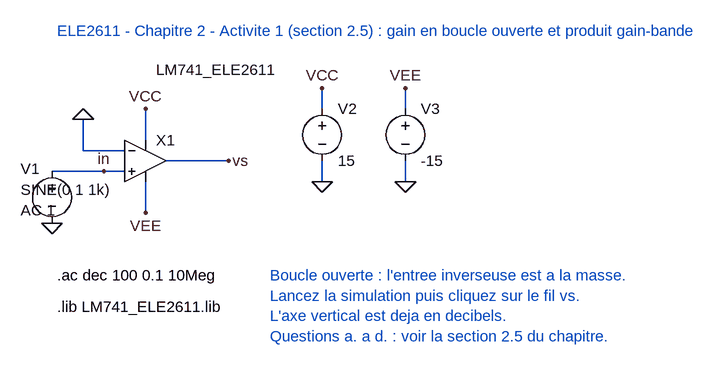
[diagram p0: schematic Ch2_Act1_GainBoucleOuverte.asc]
Ch2_Act1_GainBoucleOuverte.asc, the LTspice schematic file:
Version 4
SHEET 1 1200 700
WIRE 64 256 144 256
WIRE 144 256 176 256
WIRE 176 224 112 224
WIRE 112 176 112 224
WIRE 208 160 208 208
WIRE 208 272 208 320
WIRE 240 240 336 240
WIRE 480 128 480 160
WIRE 480 240 480 272
WIRE 608 128 608 160
WIRE 608 240 608 272
FLAG 64 336 0
FLAG 144 256 in
FLAG 112 176 0
FLAG 208 160 VCC
FLAG 208 320 VEE
FLAG 336 240 vs
FLAG 480 128 VCC
FLAG 480 272 0
FLAG 608 128 VEE
FLAG 608 272 0
SYMBOL voltage 64 240 R0
WINDOW 0 -48 12 Left 2
WINDOW 3 -48 44 Left 2
WINDOW 123 -48 76 Left 2
SYMATTR InstName V1
SYMATTR Value SINE(0 1 1k)
SYMATTR Value2 AC 1
SYMBOL Opamps\\opamp2 208 176 R0
WINDOW 3 16 -76 Left 2
SYMATTR InstName X1
SYMATTR Value LM741_ELE2611
SYMBOL voltage 480 144 R0
SYMATTR InstName V2
SYMATTR Value 15
SYMBOL voltage 608 144 R0
SYMATTR InstName V3
SYMATTR Value -15
TEXT 72 40 Left 2 ;ELE2611 - Chapitre 2 - Activite 1 (section 2.5) : gain en boucle ouverte et produit gain-bande
TEXT 72 416 Left 2 !.ac dec 100 0.1 10Meg
TEXT 72 464 Left 2 !.lib LM741_ELE2611.lib
TEXT 400 416 Left 2 ;Boucle ouverte : l'entree inverseuse est a la masse.\nLancez la simulation puis cliquez sur le fil vs.\nL'axe vertical est deja en decibels.\nQuestions a. a d. : voir la section 2.5 du chapitre.

The netlist it stands for:
* Ch2_Act1_GainBoucleOuverte.asc
V1 in 0 SINE(0 1 1k) AC 1
XX1 in 0 VCC VEE vs LM741_ELE2611  ; pins In+ In- V+ V- OUT
V2 VCC 0 15
V3 VEE 0 -15
* ELE2611 - Chapitre 2 - Activite 1 (section 2.5) : gain en boucle ouverte et produit gain-bande
.ac dec 100 0.1 10Meg
.lib LM741_ELE2611.lib
* Boucle ouverte : l'entree inverseuse est a la masse.
* Lancez la simulation puis cliquez sur le fil vs.
* L'axe vertical est deja en decibels.
* Questions a. a d. : voir la section 2.5 du chapitre.
.backanno
.end

* Results of the author's LTspice run, read from the files saved beside the schematic
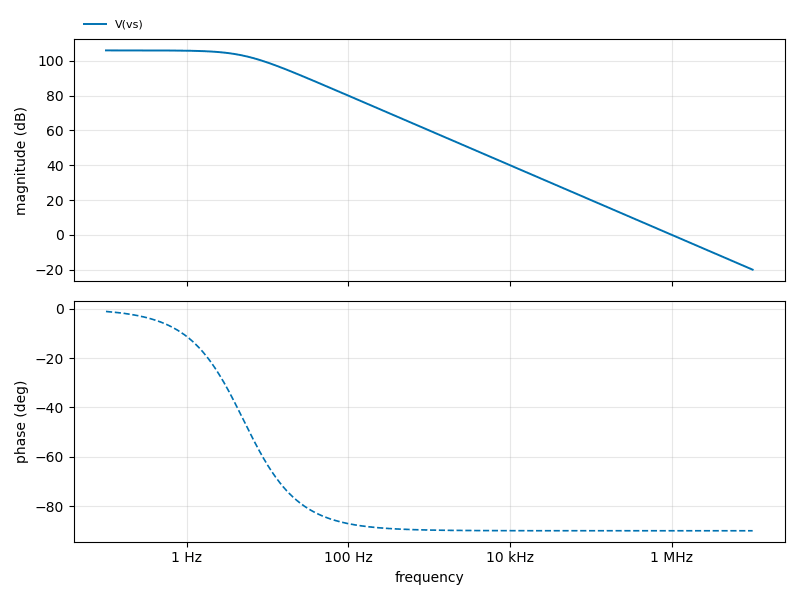
[diagram p1: AC Analysis of Ch2_Act1_GainBoucleOuverte.asc, plotted from the saved traces]
* AC Analysis, 1 run:
*   V(vs): 106.02 dB at 100 mHz, -20.00 dB at 10 MHz, peak 106.02 dB at 100 mHz, 3 dB below the peak at 5.002 Hz